# EasyEDA Pro project 传感器pack.eprj

# Schematic Schematic1

## Sheets
1 controller: Create Date: 2023-05-07; Page Name: controller; Project Name: 传感器pack; Schematic Name: Schematic1; Update Date: 2023-06-27; Company: 嘉立创EDA; Page Size: A4; Version: V1.0
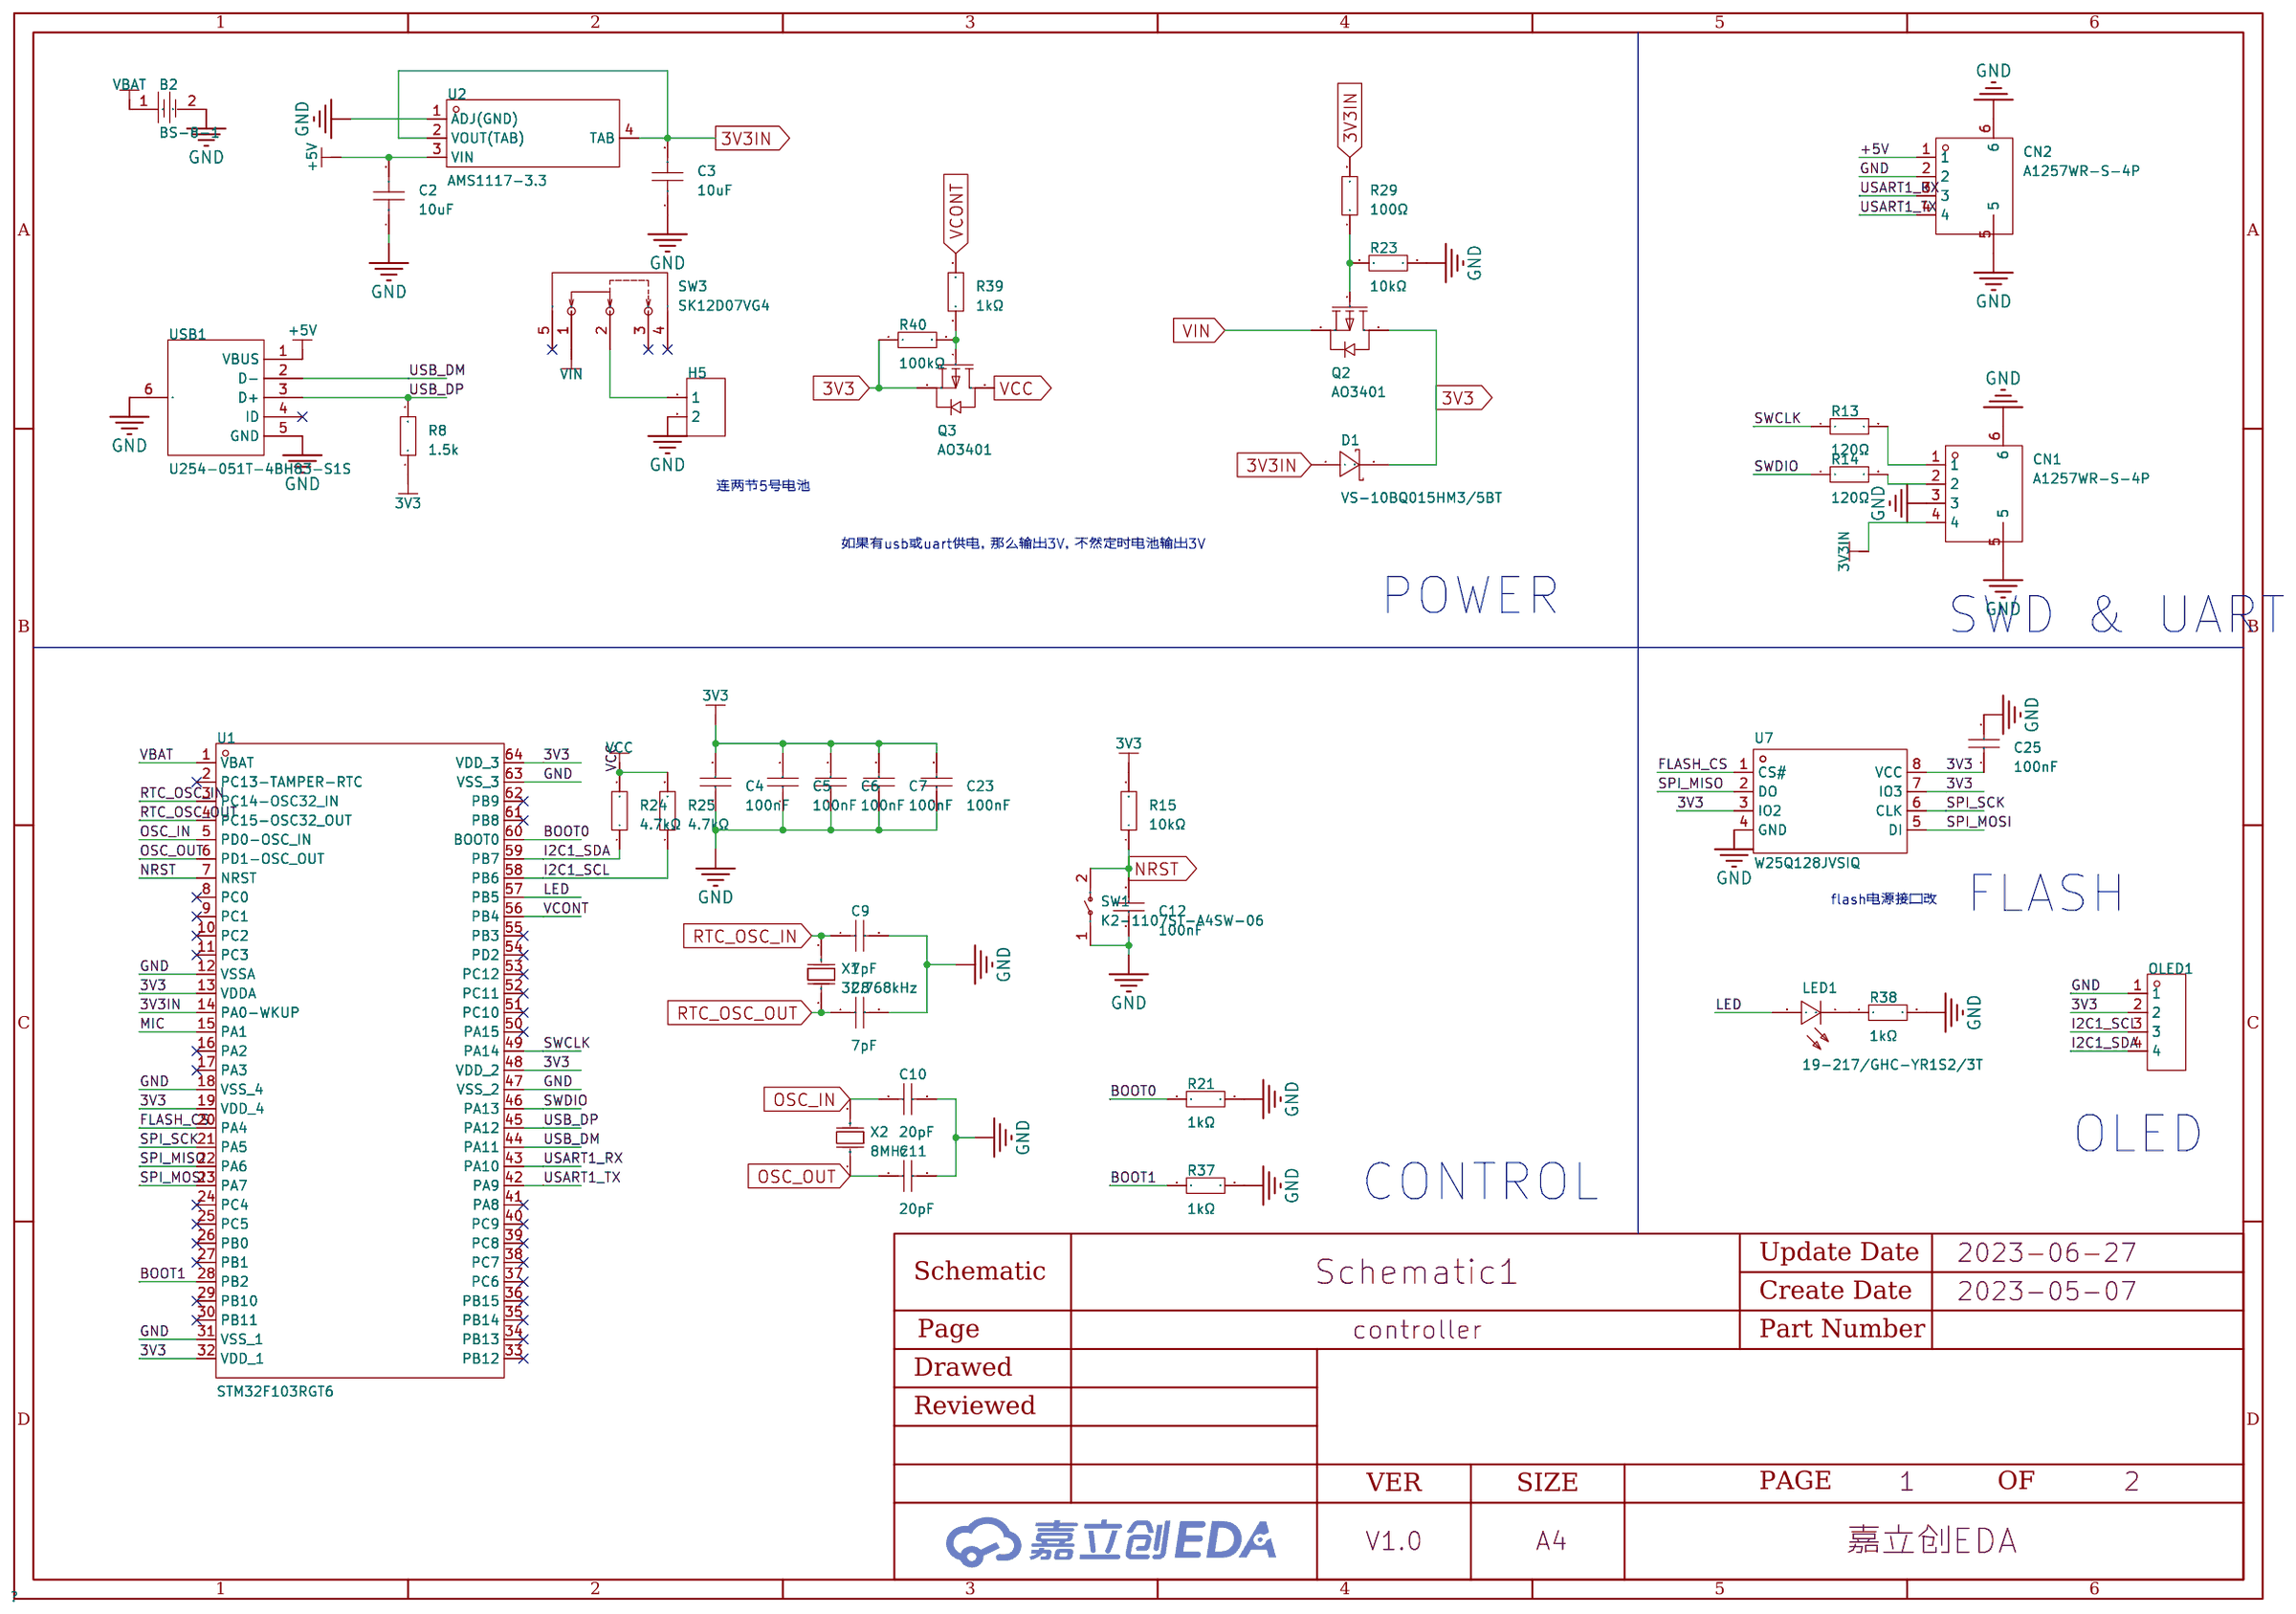
[diagram p0: controller]
2 sensor: Create Date: 2023-05-13; Page Name: sensor
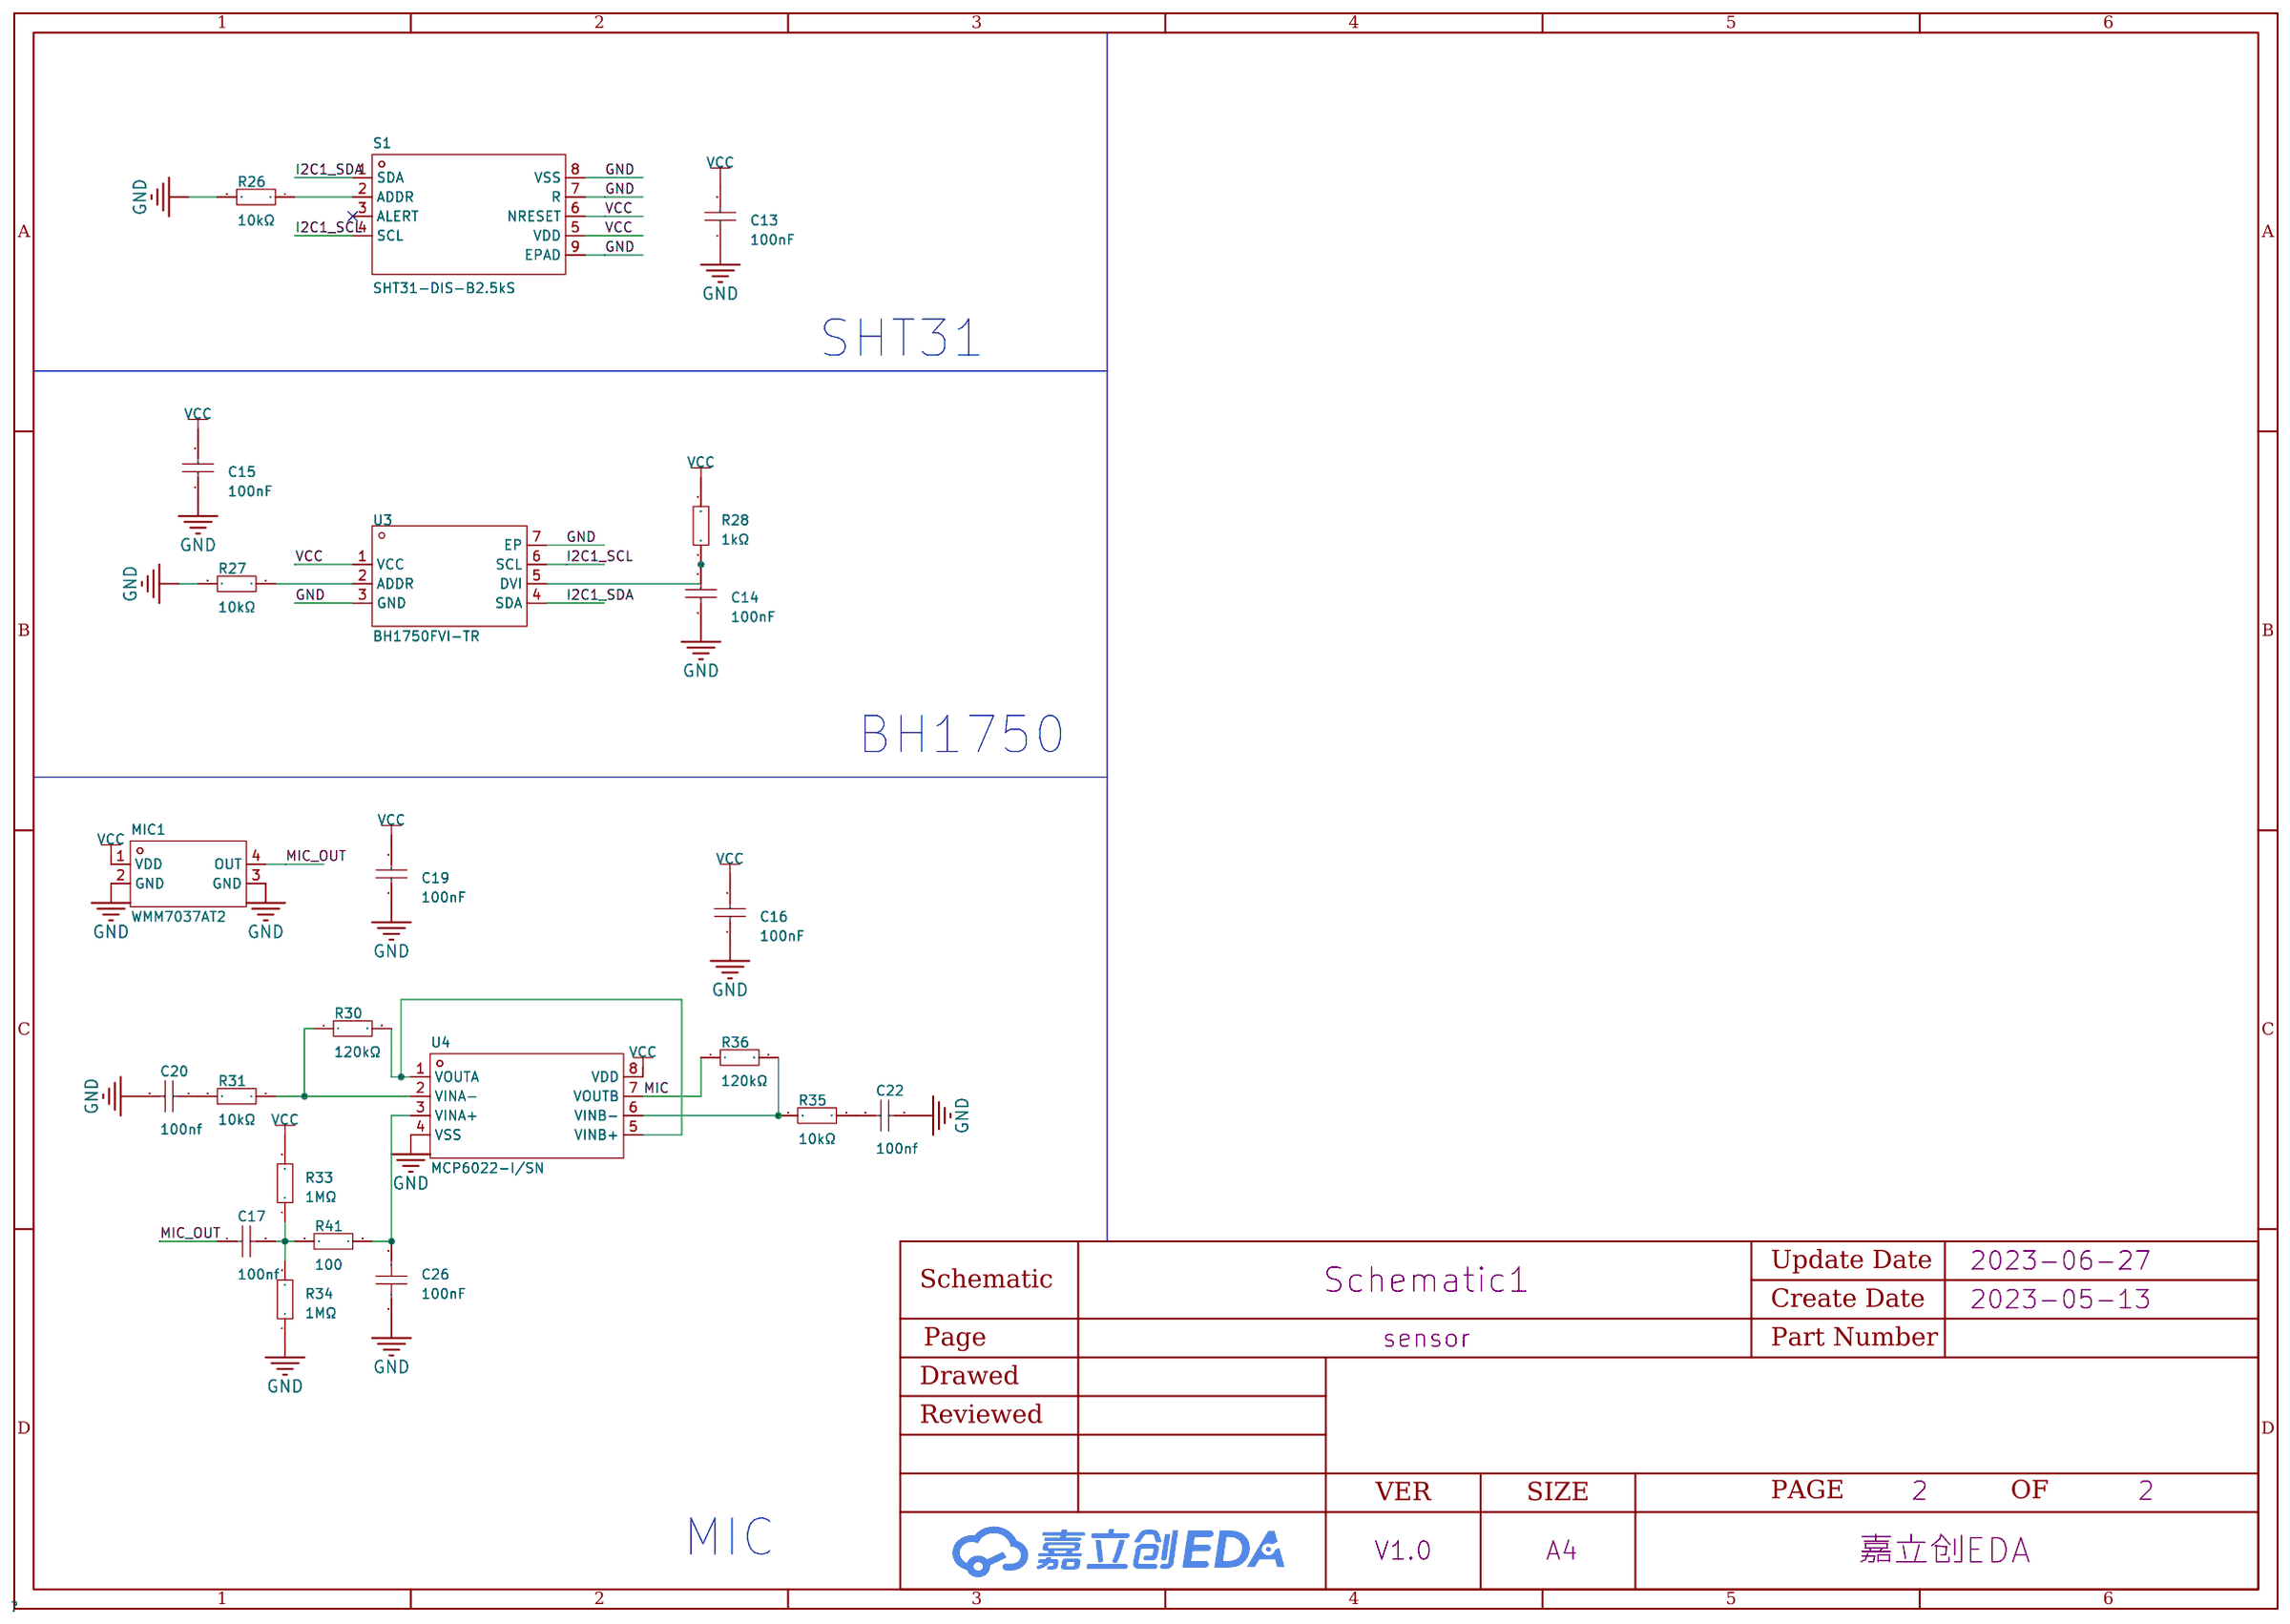
[diagram p1: sensor]

## Parts
sheet controller
B2  BS-8-1  [BAT-TH_BS-8-1]
C2  10uF  [C0603]
C3  10uF  [C0603]
C4  100nF  [C0603]
C5  100nF  [C0603]
C6  100nF  [C0603]
C7  100nF  [C0603]
C8  7pF  [C0603]
C9  7pF  [C0603]
C10  20pF  [C0603]
C11  20pF  [C0603]
C12  100nF  [C0603]
C23  100nF  [C0603]
C25  100nF  [C0603]
CN1  A1257WR-S-4P  [CONN-SMD_A1257WR-S-4P]
CN2  A1257WR-S-4P  [CONN-SMD_A1257WR-S-4P]
D1  VS-10BQ015HM3/5BT  [SMB_L4.6-W3.6-LS5.3-RD]
H5  -  [HDR-TH_2P-P2.54-V-F]
LED1  19-217/GHC-YR1S2/3T  [LED0603-RD]
OLED1  -  [HDR-TH_4P-P2.54-V-F]
Q2  AO3401  [SOT-23-3_L2.9-W1.4-P1.90-LS2.6-BR]
Q3  AO3401  [SOT-23-3_L2.9-W1.4-P1.90-LS2.6-BR]
R8  1.5k  [R0603]
R13  120Ω  [R0603]
R14  120Ω  [R0603]
R15  10kΩ  [R0603]
R21  1kΩ  [R0603]
R23  10kΩ  [R0603]
R24  4.7kΩ  [R0603]
R25  4.7kΩ  [R0603]
R29  100Ω  [R0603]
R37  1kΩ  [R0603]
R38  1kΩ  [R0603]
R39  1kΩ  [R0603]
R40  100kΩ  [R0603]
SW1  K2-1107ST-A4SW-06  [SW-SMD_L6.1-W3.6-LS7.9]
SW3  SK12D07VG4  [SW-TH_SK12D07VG4]
U1  STM32F103RGT6  [LQFP-64_L10.0-W10.0-P0.50-LS12.0-BL]
U2  AMS1117-3.3  [SOT-223-4_L6.5-W3.5-P2.30-LS7.0-BR]
U7  W25Q128JVSIQ  [SOIC-8_L5.3-W5.3-P1.27-LS8.0-BL]
USB1  U254-051T-4BH83-S1S  [MICRO-USB-SMD_U254-051T-4BH83-S1S]
X1  32.768kHz  [FC-12M_L2.0-W1.2]
X2  8MHz  [CRYSTAL-SMD_L5.0-W3.2]
sheet sensor
C13  100nF  [C0603]
C14  100nF  [C0603]
C15  100nF  [C0603]
C16  100nF  [C0603]
C17  100nf  [C0603]
C19  100nF  [C0603]
C20  100nf  [C0603]
C22  100nf  [C0603]
C26  100nF  [C0603]
MIC1  WMM7037AT2  [MIC-SMD_L3.8-W3.00-TL]
R26  10kΩ  [R0603]
R27  10kΩ  [R0603]
R28  1kΩ  [R0603]
R30  120kΩ  [R0603]
R31  10kΩ  [R0603]
R33  1MΩ  [R0603]
R34  1MΩ  [R0603]
R35  10kΩ  [R0603]
R36  120kΩ  [R0603]
R41  100  [R0603]
S1  SHT31-DIS-B2.5kS  [DFN-8_L2.5-W2.5-P0.50-BL-EP]
U3  BH1750FVI-TR  [WSOF-6_L2.6-W1.6-P0.50-TL-EP]
U4  MCP6022-I/SN  [SOIC-8_L4.9-W3.9-P1.27-LS6.0-BL]

## Library data of the parts
B2 = BS-8-1: 连接器类型:电池底座;适用电池规格:CR2032;工作温度范围:-55℃~+85℃;; LCSC Part Name: 电池底座 适用电池:CR2032 镀金; Supplier Part: C70378; Manufacturer: Q&J; Supplier Footprint: SMD; JLCPCB Part Class: Extended Part; Datasheet: https://atta.szlcsc.com/upload/public/pdf/source/20160427/1461725216590.pdf; Supplier: LCSC; Connector Type: 电池底座; Battery Type: CR2032; Operating Temperature Range: -55℃~+85℃
C2 C3 = CL10A106MA8NRNC: 容值:10uF;精度:±20%;额定电压:25V;材质(温度系数):X5R;; LCSC Part Name: 10uF ±20% 25V; Supplier Part: C96446; Manufacturer: SAMSUNG(三星); Supplier Footprint: 0603; JLCPCB Part Class: Basic Part; Datasheet: https://atta.szlcsc.com/upload/public/pdf/source/20170325/1490427913016.pdf; Supplier: LCSC; Tolerance: ±20%; Voltage Rated: 25V; Temperature Coefficient: X5R
C4-C7 C12-C16 C19 C20 C22 C23 C25 = 0603B104K500NT: 容值:100nF;精度:±10%;额定电压:50V;材质(温度系数):X7R;; LCSC Part Name: 100nF ±10% 50V; Supplier Part: C30926; Manufacturer: FH(风华); Supplier Footprint: 0603; JLCPCB Part Class: Extended Part; Datasheet: https://atta.szlcsc.com/upload/public/pdf/source/20170923/C30926_1506149436298988724.pdf; Supplier: LCSC; Tolerance: ±10%; Voltage Rated: 50V; Temperature Coefficient: X7R
C8 C9 = 0603CG7R0C500NT: 容值:7pF;额定电压:50V;材质(温度系数):C0G;; LCSC Part Name: 7pF 50V ±0.25pF; Supplier Part: C1682; Manufacturer: FH(风华); Supplier Footprint: 0603; JLCPCB Part Class: Extended Part; Datasheet: https://atta.szlcsc.com/upload/public/pdf/source/20170923/C1682_1506149316801988467.pdf; Supplier: LCSC; Voltage Rated: 50V; Temperature Coefficient: C0G
C10 C11 = CL10C200JB8NNNC: 容值:20pF;精度:±5%;额定电压:50V;材质(温度系数):C0G;; LCSC Part Name: 20pF ±5% 50V; Supplier Part: C1648; Manufacturer: SAMSUNG(三星); Supplier Footprint: 0603; JLCPCB Part Class: Basic Part; Datasheet: https://atta.szlcsc.com/upload/public/pdf/source/20160103/1457707686863.pdf; Supplier: LCSC; Tolerance: ±5%; Voltage Rated: 50V; Temperature Coefficient: C0G
CN1 CN2 = A1257WR-S-4P: 参考系列:GH;间距:1.25mm;插针结构:1x4P;排数:1;每排PIN数:4;行距:-;安装方式:-;触头材质:黄铜;; LCSC Part Name: GH1.25卧式贴片 镀锡 4P 针座连接器; Supplier Part: C225127; Manufacturer: CJT(长江连接器); Supplier Footprint: SMD,P=1.25mm; JLCPCB Part Class: Extended Part; Datasheet: https://atta.szlcsc.com/upload/public/pdf/source/20180509/C225127_D8D3C7F8F1F45F960D198B1E232900BE.pdf; Supplier: LCSC; Reference Series: GH; Pitch: 1.25mm; Pins Structure: 1x4P; Number of Rows: 1; Number of PINs Per Row: 4; Contact Material: 黄铜
D1 = VS-10BQ015HM3/5BT: 直流反向耐压(Vr):15V;平均整流电流(Io):1A;正向压降(Vf):210mV@1A;; LCSC Part Name: 15V 1A 210mV@1A; Supplier Part: C413465; Manufacturer: VISHAY(威世); Supplier Footprint: SMB; JLCPCB Part Class: Extended Part; Datasheet: https://atta.szlcsc.com/upload/public/pdf/source/20190819/C413465_3D2B1A8C7366D4425AB887DF85498F89.pdf; Supplier: LCSC; Reverse Voltage (Vr): 15V; Average Rectified Current (Io): 1A; Forward Voltage (Vf@If): 210mV@1A
H5 = HDR-F_2.54_1x2P: Supplier Part: C49661; Supplier Footprint: 插件
LED1 = 19-217/GHC-YR1S2/3T: 发光颜色:翠绿;二极管配置:-;主波长:520nm~535nm;色温:-;功率:110mW;安装方式:-;; Supplier Part: C72043; Manufacturer: EVERLIGHT(亿光); Supplier Footprint: 0603; JLCPCB Part Class: Basic Part; Datasheet: https://atta.szlcsc.com/upload/public/pdf/source/20160507/1462613613780.pdf; Supplier: LCSC; Emitted Color: 翠绿; Lens Color: 无色透明; Dominant Wavelength: 520nm~535nm; Peak Wavelength: 518nm; Forward Current: 20mA; Power Dissipation: 110mW; Viewing Angle: 120°; Operating Temperature: -40℃~+85℃
OLED1 = HDR-F_2.54_1x4P: Supplier Part: C2718488; Supplier Footprint: 插件
Q2 Q3 = AO3401_C727156: 类型:P沟道;漏源电压(Vdss):30V;连续漏极电流(Id):4.2A;功率(Pd):350mW;导通电阻(RDS(on)@Vgs,Id):65mΩ@10V,4.2A;; LCSC Part Name: P沟道 30V 4.2A; Supplier Part: C727156; Manufacturer: TWGMC(台湾迪嘉); Supplier Footprint: SOT-23; JLCPCB Part Class: Extended Part; Datasheet: https://atta.szlcsc.com/upload/public/pdf/source/20200827/C727156_6E081BBEEFBC6B8FEE164CB196B0AF30.pdf; Supplier: LCSC; Type: P沟道; Drain Source Voltage (Vdss): 30V; Continuous Drain Current (Id): 4.2A; Power Dissipation (Pd): 350mW; Drain Source On Resistance (RDS(on)@Vgs,Id): 65mΩ@10V,4.2A; Gate Threshold Voltage (Vgs(th)@Id): 1.3V@250uA
R8 R24 R25 = 0603WAF4701T5E: 电阻类型:厚膜电阻;阻值:4.7kΩ;精度:±1%;功率:100mW;; LCSC Part Name: 4.7kΩ ±1% 100mW; Supplier Part: C23162; Manufacturer: UNI-ROYAL(厚声); Supplier Footprint: 0603; JLCPCB Part Class: Basic Part; Datasheet: https://atta.szlcsc.com/upload/public/pdf/source/20200306/C422600_1E6D84923E4A46A82E41ADD87F860B5C.pdf; Supplier: LCSC; Type: 厚膜电阻; Tolerance: ±1%; Power(Watts): 100mW; Temperature Coefficient: ±100ppm/℃; Overload Voltage (Max): 75V; Operating Temperature Range: -55℃~+155℃
R13 R14 = 0603WAF1200T5E: 电阻类型:厚膜电阻;阻值:120Ω;精度:±1%;功率:100mW;; LCSC Part Name: 120Ω ±1% 100mW; Supplier Part: C22787; Manufacturer: UNI-ROYAL(厚声); Supplier Footprint: 0603; JLCPCB Part Class: Basic Part; Datasheet: https://atta.szlcsc.com/upload/public/pdf/source/20200306/C422600_1E6D84923E4A46A82E41ADD87F860B5C.pdf; Supplier: LCSC; Type: 厚膜电阻; Tolerance: ±1%; Power(Watts): 100mW; Temperature Coefficient: ±100ppm/℃; Overload Voltage (Max): 75V; Operating Temperature Range: -55℃~+155℃
R15 R23 R26 R27 R31 R35 = 0603WAF1002T5E: 电阻类型:厚膜电阻;阻值:10kΩ;精度:±1%;功率:100mW;; LCSC Part Name: 厚膜电阻 10kΩ ±1% 100mW; Supplier Part: C25804; Manufacturer: UNI-ROYAL(厚声); Supplier Footprint: 0603; JLCPCB Part Class: Basic Part; Datasheet: https://atta.szlcsc.com/upload/public/pdf/source/20200306/C422600_1E6D84923E4A46A82E41ADD87F860B5C.pdf; Supplier: LCSC; Type: 厚膜电阻; Tolerance: ±1%; Power(Watts): 100mW; Temperature Coefficient: ±100ppm/℃; Overload Voltage (Max): 75V; Operating Temperature Range: -55℃~+155℃
R21 R28 R37-R39 = 0603WAF1001T5E: 电阻类型:厚膜电阻;阻值:1kΩ;精度:±1%;功率:100mW;; LCSC Part Name: 1kΩ ±1% 100mW; Supplier Part: C21190; Manufacturer: UNI-ROYAL(厚声); Supplier Footprint: 0603; JLCPCB Part Class: Basic Part; Datasheet: https://atta.szlcsc.com/upload/public/pdf/source/20200306/C422600_1E6D84923E4A46A82E41ADD87F860B5C.pdf; Supplier: LCSC; Type: 厚膜电阻; Tolerance: ±1%; Power(Watts): 100mW; Temperature Coefficient: ±100ppm/℃; Overload Voltage (Max): 75V; Operating Temperature Range: -55℃~+155℃
R29 = 0603WAF1000T5E: 电阻类型:厚膜电阻;阻值:100Ω;精度:±1%;功率:100mW;; LCSC Part Name: 100Ω ±1% 100mW; Supplier Part: C22775; Manufacturer: UNI-ROYAL(厚声); Supplier Footprint: 0603; JLCPCB Part Class: Basic Part; Datasheet: https://atta.szlcsc.com/upload/public/pdf/source/20200306/C422600_1E6D84923E4A46A82E41ADD87F860B5C.pdf; Supplier: LCSC; Type: 厚膜电阻; Tolerance: ±1%; Power(Watts): 100mW; Temperature Coefficient: ±200ppm/℃; Overload Voltage (Max): 75V; Operating Temperature Range: -55℃~+155℃
R40 = 0603WAF1003T5E: 电阻类型:厚膜电阻;阻值:100kΩ;精度:±1%;功率:100mW;; LCSC Part Name: 100kΩ ±1% 100mW; Supplier Part: C25803; Manufacturer: UNI-ROYAL(厚声); Supplier Footprint: 0603; JLCPCB Part Class: Basic Part; Datasheet: https://atta.szlcsc.com/upload/public/pdf/source/20200306/C422600_1E6D84923E4A46A82E41ADD87F860B5C.pdf; Supplier: LCSC; Type: 厚膜电阻; Tolerance: ±1%; Power(Watts): 100mW; Temperature Coefficient: ±100ppm/℃; Overload Voltage (Max): 75V; Operating Temperature Range: -55℃~+155℃
SW1 = K2-1107ST-A4SW-06: 触点电流:50mA;额定电压(DC):12V;绝缘电阻:100MΩ;安装方式:立贴;作用力:250gf@±30gf;机械寿命:100000;工作温度:-25℃~+85℃;开关长度:6mm;开关宽度:3.6mm;开关高度:2.5mm;; Supplier Part: C2837195; Manufacturer: 韩国韩荣; Supplier Footprint: SMD; JLCPCB Part Class: Extended Part; Datasheet: https://atta.szlcsc.com/upload/public/pdf/source/20210810/381712CEF248770C072B585C3485C888.pdf; Supplier: LCSC; Contact Current: 50mA; Voltage Rating (DC): 12V; Insulation Resistance: 100MΩ; Mounting Style: 立贴; Operating Force: 250gf@±30gf; Mechanical Life: 100000; Operating Temperature: -25℃~+85℃; Switch Length: 6mm; Switch Width: 3.6mm; Switch Height: 2.5mm
SW3 = SK12D07VG4: 额定电压 DC:50V;触点额定电流:500mA @ 50VDC;电路结构:SPDT;额定电压 AC:-;开关功能:On-On;; LCSC Part Name: 3脚2二档位SK12D07VG4滑动开关1P2T卧式拨动开关; Supplier Part: C393937; Manufacturer: SHOU HAN(首韩); Supplier Footprint: 插件,P=2mm; JLCPCB Part Class: Extended Part; Datasheet: https://atta.szlcsc.com/upload/public/pdf/source/20190521/C393937_939FE26E571CC67D2D532E953108A1B0.pdf; Supplier: LCSC; Operating Force: 130~330gf; Contact Material: Brass; Rated Voltage(DC): 50V; Contact Rating @ Voltage: 500mA @ 50VDC; Circuit: SPDT; Electrical Life Cycles: 5000; Mounting Type: Through Hole, Right Angle; Switch Function: On-On; Switch Height: 4mm; Actuator Orientation: Horizontal; Contact Timing: Shorting (MBB); Termination Style: PC 引脚; Actuator Type: Standard
U1 = STM32F103RGT6: CPU内核:ARM Cortex-M3;CPU最大主频:72MHz;程序存储容量:1MB;程序存储器类型:FLASH;RAM总容量:96KB;GPIO端口数量:51;; LCSC Part Name: ARM Cortex-M3 72MHz; Supplier Part: C8317; Manufacturer: ST(意法半导体); Supplier Footprint: LQFP-64(10x10); JLCPCB Part Class: Extended Part; Datasheet: https://atta.szlcsc.com/upload/public/pdf/source/20140724/1457707171207.pdf; Supplier: LCSC; CPU Core: ARM Cortex-M3; CPU Maximum Speed: 72MHz; Operating Voltage Range: 2V~3.6V; Program Storage Size: 1MB; Program Memory Type: FLASH; RAM Size: 96KB; EEPROM: 1MB; GPIO Ports Number: 51; ADC (Bit): 12bit; DAC (Bit): 12bit; Universal Serial Bus: 有; Peripheral/Function: 看门狗；DMA；看门狗；片载温度传感器; Watchdog: 有; Infrared Data Association: 有; Low-Voltage Detect: 有; Direct Memory Access: 有; Internal Oscillator: 有; Operating Temperature Range: -40℃~+85℃
U2 = AMS1117-3.3_C347222: 输出类型:固定;输出极性:正;最大输入电压:18V;输出电压:3.3V;输出电流:1A;电源纹波抑制比(PSRR):60dB@(120Hz);; Supplier Part: C347222; Manufacturer: UMW(广东友台半导体); Supplier Footprint: SOT-223; JLCPCB Part Class: Extended Part; Datasheet: https://atta.szlcsc.com/upload/public/pdf/source/20211011/50CC665C22E3A66C08379A4A74BDA25C.pdf; Supplier: LCSC; Output Type: 固定; Output Polarity: 正; Number of Outputs: 1; Maximum Input Voltage: 18V; Output Voltage: 3.3V; Dropout Voltage: 1.3V@(1A); Output Current: 1A; Power Supply Rejection Ratio (PSRR): 60dB@(120Hz)
U7 = W25Q128JVSIQ: 128Mbit(16MBx8bit),高速版,133MHz(266/532MHz Dual/Quad-SPI,66MB/S),比W25Q128FVSIG,W25Q128FVFIG更高速; Supplier Part: C97521; Manufacturer: WINBOND(华邦); Supplier Footprint: SOIC-8-208mil; JLCPCB Part Class: Basic Part; Datasheet: https://atta.szlcsc.com/upload/public/pdf/source/20170316/1489627409956.pdf; Supplier: LCSC
USB1 = U254-051T-4BH83-S1S: 连接器类型:Micro-B;标准:USB 2.0;公母:母座;触点数量:5;端口数量:1;安装方式:卧贴;额定电流 - 电源:1.8A;触头材质:铜合金;触头镀层:金;工作温度范围:-20℃~+85℃;焊接温度(最大值):260℃;; LCSC Part Name: Micro-B 母座 卧贴; Supplier Part: C319160; Manufacturer: XKB Connectivity(中国星坤); Supplier Footprint: SMD; JLCPCB Part Class: Extended Part; Datasheet: https://atta.szlcsc.com/upload/public/pdf/source/20200303/C482359_94FADDBDAD8A1CD1662C83166295E6D9.pdf; Supplier: LCSC; Connector Type: Micro-B; Standard: USB 2.0; Gender: 母座; Number of Contacts: 5; Number of Ports: 1; Mounting Style: 卧贴; Current Rating - Power (Max): 1.8A; Contact Material: 铜合金; Contact Plating: 金; Operating Temperature Range: -20℃~+85℃; Welding Temperature (Max): 260℃
X1 = FC-12M32.768KHZ7PF20PPM: 频率:32.768kHz;频率公差:±20ppm;负载电容:7pF;; LCSC Part Name: 32.768kHz ±20ppm 7pF; Supplier Part: C99009; Manufacturer: EPSON(爱普生); Supplier Footprint: SMD2012-2P; JLCPCB Part Class: Extended Part; Datasheet: https://atta.szlcsc.com/upload/public/pdf/source/20201208/C99009_C8E15F958CFE3CE2EDA27C0490B1C4AB.pdf; Supplier: LCSC; Crystal Type: 贴片无源晶振; Frequency Tolerance: ±20ppm; Load Capacitance: 7pF; Equivalent Series Resistance (ESR): 90kΩ; Operating Temperature: -40℃~+85℃
X2 = X50328MSB2GI: 频率:8MHz;频率公差:±10ppm;负载电容:20pF;; LCSC Part Name: 8MHz ±10ppm 20pF YSX530GA; Supplier Part: C115962; Manufacturer: YXC(扬兴晶振); Supplier Footprint: SMD5032-2P; JLCPCB Part Class: Basic Part; Datasheet: https://atta.szlcsc.com/upload/public/pdf/source/20230220/0EBFFB9D6D8CE6A211407822BBB6C516.pdf; Supplier: LCSC; Crystal Type: 贴片无源晶振; Frequency Tolerance: ±10ppm; Frequency Stability: ±50ppm; Load Capacitance: 20pF; Operating Temperature: -40℃~+85℃
C17 = CL10A105KB8NNNC: 容值:1uF;精度:±10%;额定电压:50V;材质(温度系数):X5R;; LCSC Part Name: 1uF ±10% 50V; Supplier Part: C15849; Manufacturer: SAMSUNG(三星); Supplier Footprint: 0603; JLCPCB Part Class: Basic Part; Datasheet: https://atta.szlcsc.com/upload/public/pdf/source/20160103/1457707679084.pdf; Supplier: LCSC; Tolerance: ±10%; Voltage Rated: 50V; Temperature Coefficient: X5R
C26 = CAP_0603: Supplier Footprint: 0603
MIC1 = WMM7037AT2: 方向:全指向;灵敏度:-42dB;信噪比:59dB;电流消耗:80uA;电源电压:1.5V~3.6V;阻抗:200Ω;; LCSC Part Name: 3.76*2.95*1.1; Supplier Part: C140705; Manufacturer: WILLSEMI(韦尔); Supplier Footprint: LGA-4(3x3.8); JLCPCB Part Class: Extended Part; Datasheet: https://atta.szlcsc.com/upload/public/pdf/source/20171110/C140705_15102791561741104113.pdf; Supplier: LCSC; Direction: 全指向; Sensitivity: -42dB; SNR(Signal to Noise Ratio): 59dB; Current Consumption: 80uA; Supply Voltage: 1.5V~3.6V; Impedance: 200Ω
R30 R36 = 0603WAF1203T5E: 电阻类型:厚膜电阻;阻值:120kΩ;精度:±1%;功率:100mW;; LCSC Part Name: 120kΩ ±1% 100mW; Supplier Part: C25808; Manufacturer: UNI-ROYAL(厚声); Supplier Footprint: 0603; JLCPCB Part Class: Basic Part; Datasheet: https://atta.szlcsc.com/upload/public/pdf/source/20200306/C422600_1E6D84923E4A46A82E41ADD87F860B5C.pdf; Supplier: LCSC; Type: 厚膜电阻; Tolerance: ±1%; Power(Watts): 100mW; Temperature Coefficient: ±100ppm/℃; Overload Voltage (Max): 75V; Operating Temperature Range: -55℃~+155℃
R33 R34 = 0603WAF1004T5E: 电阻类型:厚膜电阻;阻值:1MΩ;精度:±1%;功率:100mW;; LCSC Part Name: 1MΩ ±1% 100mW; Supplier Part: C22935; Manufacturer: UNI-ROYAL(厚声); Supplier Footprint: 0603; JLCPCB Part Class: Basic Part; Datasheet: https://atta.szlcsc.com/upload/public/pdf/source/20200306/C422600_1E6D84923E4A46A82E41ADD87F860B5C.pdf; Supplier: LCSC; Type: 厚膜电阻; Tolerance: ±1%; Power(Watts): 100mW; Temperature Coefficient: ±100ppm/℃; Overload Voltage (Max): 75V; Operating Temperature Range: -55℃~+155℃
R41 = Res_0603: Supplier Footprint: 0603
S1 = SHT31-DIS-B2.5kS: 数字式温湿度传感器SHT31， RH精度：0-100%全量程典型误差值±2%，比SHT30更高精度，DFN封装，; Supplier Part: C80862; Manufacturer: Sensirion(瑞士盛思锐); Supplier Footprint: DFN-8-EP(3x3); JLCPCB Part Class: Extended Part; Datasheet: https://atta.szlcsc.com/upload/public/pdf/source/20160903/1472896604401.pdf; Supplier: LCSC
U3 = BH1750FVI-TR: 数字16-bit I2C串行输出，环境光传感器，工作电压：2.4V~3.6V; Supplier Part: C78960; Manufacturer: ROHM(罗姆); Supplier Footprint: WSOF-6; JLCPCB Part Class: Extended Part; Datasheet: https://atta.szlcsc.com/upload/public/pdf/source/20160723/1469258984787.pdf; Supplier: LCSC
U4 = MCP6022-I/SN: 运放类型:宽带运放;放大器组数:2;增益带宽积（GBP）:10MHz;压摆率（SR）:7 V/us;电源电压:2.5V ~ 5.5V;各通道供电电流:1mA;; Supplier Part: C34047; Manufacturer: MICROCHIP(美国微芯); Supplier Footprint: SOIC-8-150mil; JLCPCB Part Class: Extended Part; Datasheet: https://atta.szlcsc.com/upload/public/pdf/source/20140723/1457707156733.pdf; Supplier: LCSC; Amplifier Type: 宽带运放; Number of Circuits: 2; Current - Input Bias（Ib）: 1pA; Voltage - Input Offset（Vos）: 500uV; Gain Bandwidth Product（GBP）: 10MHz; Slew Rate（SR）: 7 V/us; Output Type: 满摆幅; Supply Voltage（Single）: 2.5V ~ 5.5V; Iq per channel (Typ): 1mA; Operating Temperature: -40℃~85℃

## Nets
3V3: C4.2 C5.2 C6.2 C7.2 C23.2 C25.1 D1.1(C) OLED1.2 Q2.3(D) Q3.2(S) R8.1 R15.2 R40.1 U1.13(VDDA) U1.19(VDD_4) U1.32(VDD_1) U1.48(VDD_2) U1.64(VDD_3) U7.3(IO2) U7.7(IO3) U7.8(VCC)
3V3IN: C3.2 CN1.4 D1.2(A) R29.2 U1.14(PA0-WKUP) U2.2(VOUT(TAB)) U2.4(TAB)
+5V: C2.2 CN2.1 U2.3(VIN) USB1.1(VBUS)
GND: B2.2 C2.1 C3.1 C4.1 C5.1 C6.1 C7.1 C8.2 C9.2 C10.2 C11.2 C12.1 C13.1 C14.1 C15.1 C16.1 C19.1 C20.2 C22.2 C23.1 C25.2 C26.1 CN1.3 CN1.5 CN1.6 CN2.2 CN2.5 CN2.6 H5.2 MIC1.2(GND) MIC1.3(GND) OLED1.1 R21.2 R23.1 R26.2 R27.2 R34.1 R37.2 R38.2 S1.7(R) S1.8(VSS) S1.9(EPAD) SW1.1 U1.12(VSSA) U1.18(VSS_4) U1.31(VSS_1) U1.47(VSS_2) U1.63(VSS_3) U2.1(ADJ(GND)) U3.3(GND) U3.7(EP) U4.4(VSS) U7.4(GND) USB1.5(GND) USB1.6(EH)
VBAT: B2.1 U1.1(VBAT)
VCC: C13.2 C15.2 C16.2 C19.2 MIC1.1(VDD) Q3.3(D) R24.2 R25.2 R28.2 R33.2 S1.5(VDD) S1.6(NRESET) U3.1(VCC) U4.8(VDD)
VIN: Q2.2(S) SW3.1
BOOT0: R21.1 U1.60(BOOT0)
BOOT1: R37.1 U1.28(PB2)
FLASH_CS: U1.20(PA4) U7.1(CS#)
I2C1_SCL: OLED1.3 R25.1 S1.4(SCL) U1.58(PB6) U3.6(SCL)
I2C1_SDA: OLED1.4 R24.1 S1.1(SDA) U1.59(PB7) U3.4(SDA)
LED: LED1.2(A) U1.57(PB5)
MIC: R36.1 U1.15(PA1) U4.7(VOUTB)
MIC_OUT: C17.1 MIC1.4(OUT)
NRST: C12.2 R15.1 SW1.2 U1.7(NRST)
OSC_IN: C10.1 U1.5(PD0-OSC_IN) X2.2(OSC2)
OSC_OUT: C11.1 U1.6(PD1-OSC_OUT) X2.1(OSC1)
RTC_OSC_IN: C9.1 U1.3(PC14-OSC32_IN) X1.2(OSC2)
RTC_OSC_OUT: C8.1 U1.4(PC15-OSC32_OUT) X1.1(OSC1)
SPI_MISO: U1.22(PA6) U7.2(DO)
SPI_MOSI: U1.23(PA7) U7.5(DI)
SPI_SCK: U1.21(PA5) U7.6(CLK)
SWCLK: R13.1 U1.49(PA14)
SWDIO: R14.1 U1.46(PA13)
USART1_RX: CN2.3 U1.43(PA10)
USART1_TX: CN2.4 U1.42(PA9)
USB_DM: U1.44(PA11) USB1.2(D-)
USB_DP: R8.2 U1.45(PA12) USB1.3(D+)
VCONT: R39.2 U1.56(PB4)
$1N4035: Q2.1(G) R23.2 R29.1
$1N4154: CN1.1 R13.2
$1N4190: CN1.2 R14.2
$1N11068: LED1.1(C) R38.1
$1N11257: H5.1 SW3.2
$1N13765: Q3.1(G) R39.1 R40.2
$2N250: R26.1 S1.2(ADDR)
$2N452: R27.1 U3.2(ADDR)
$2N578: C14.2 R28.1 U3.5(DVI)
$2N2027: C20.1 R31.2
$2N2052: R30.1 R31.1 U4.2(VINA-)
$2N2158: R30.2 U4.1(VOUTA) U4.5(VINB+)
$2N2251: C22.1 R35.2
$2N2310: R35.1 R36.2 U4.6(VINB-)
$2N5780: C17.2 R33.1 R34.2 R41.1
$2N5887: C26.2 R41.2 U4.3(VINA+)

Not connected (* = marked no-connect by the designer): S1 3(ALERT)*; SW3 3* 4* 5*; U1 2(PC13-TAMPER-RTC)* 8(PC0)* 9(PC1)* 10(PC2)* 11(PC3)* 16(PA2)* 17(PA3)* 24(PC4)* 25(PC5)* 26(PB0)* 27(PB1)* 29(PB10)* 30(PB11)* 33(PB12)* 34(PB13)* 35(PB14)* 36(PB15)* 37(PC6)* 38(PC7)* 39(PC8)* 40(PC9)* 41(PA8)* 50(PA15)* 51(PC10)* 52(PC11)* 53(PC12)* 54(PD2)* 55(PB3)* 61(PB8)* 62(PB9)*; USB1 4(ID)*

## Notes on the sheets
sheet 1
- 连两节5号电池
- 如果有usb或uart供电，那么输出3V，不然定时电池输出3V
- POWER
- SWD & UART
- flash电源接口改
- FLASH
- OLED
- CONTROL
sheet 2
- SHT31
- BH1750
- MIC

# Board PCB1
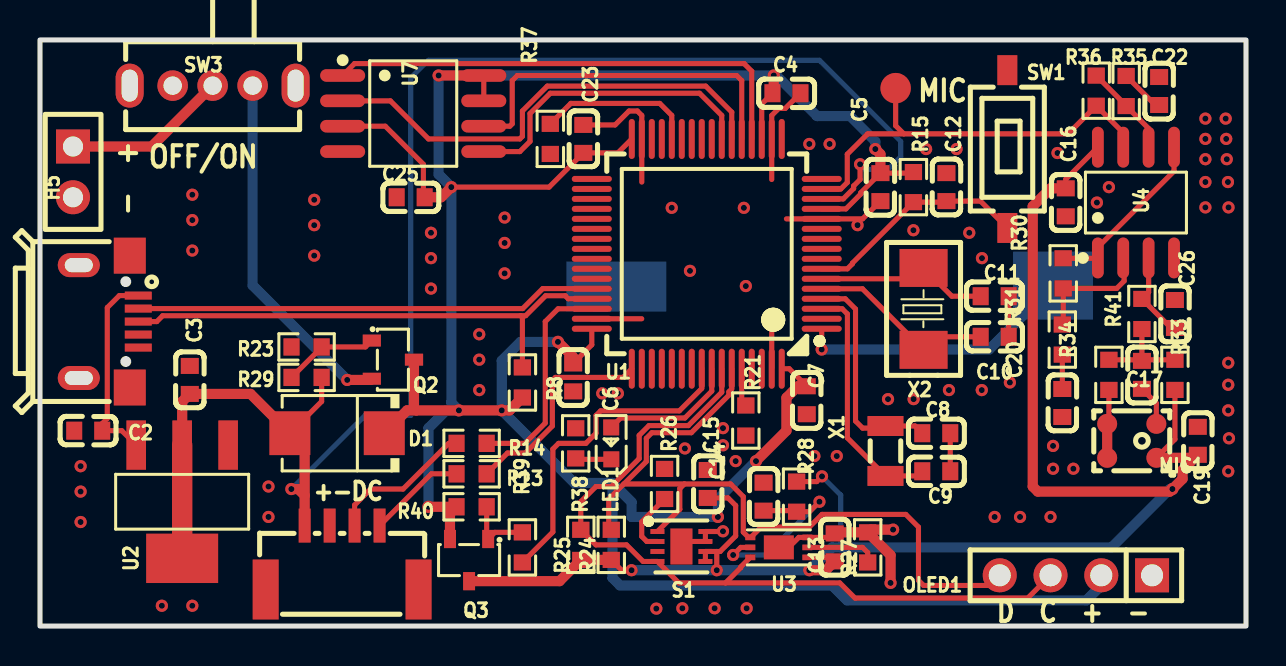
[diagram p2: board, top side]
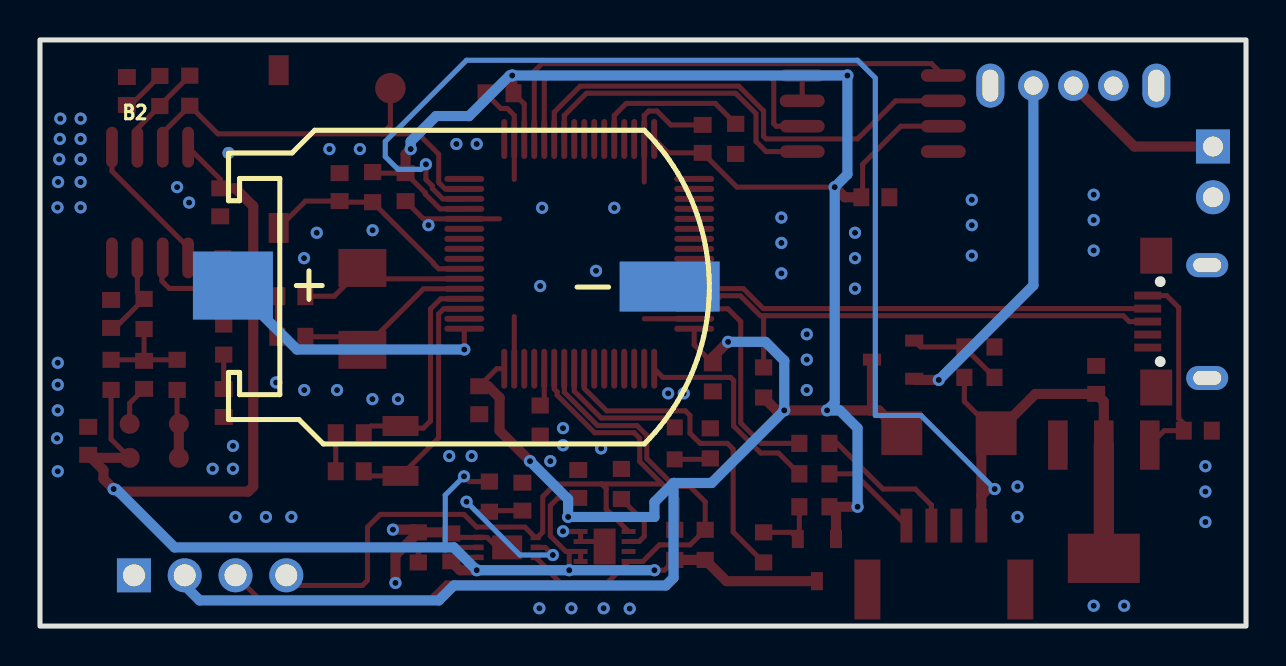
[diagram p3: board, bottom side, seen from below]

Outline 60.33 x 29.34 mm; copper layers: Top Layer, Bottom Layer. Coordinates in mm from the lower left corner of the outline.
Outline path: rectangle 0,29.34 60.33,0
Stack: Top Layer 0.035mm / Dielectric1 1.51mm FR4 er 4.5 / Bottom Layer 0.035mm

## Design rules (mm)
net RTC_OSC_OUT: DP1
net RTC_OSC_IN: DP1
template: JLCPCB Capability(Two Layers Board)
spacing copperThickness1oz (default): track to track 0.102, other pairs 0.152 to 0.3
spacing copperThickness2oz: track to track 0.203, other pairs 0.152 to 0.3
track width copperThickness1oz (default): min 0.127, default 0.254, max 2.54
track width copperThickness2oz: min 0.203, default 0.254, max 2.54
differential pair differentialPair (default): width min 0.127, default 0.254, max 2.54; gap min 0.152, default 0.152
via viaSize (default): diameter min 0.5, default 0.61, max 10; hole min 0.3, default 0.305, max 6.3

## Placement (name value [footprint] x y rotation side)
B2  BS-8-1  [BAT-TH_BS-8-1]  39.75 17.02 180 bottom
C2  10uF  [C0603]  2.41 9.78 0 top
C3  10uF  [C0603]  7.49 12.32 270 top
C4  100nF  [C0603]  37.34 26.67 180 top
C5  100nF  [C0603]  42.04 21.97 90 top
C6  100nF  [C0603]  26.67 12.45 90 top
C7  100nF  [C0603]  38.35 11.3 90 top
C8  7pF  [C0603]  44.83 9.65 180 top
C9  7pF  [C0603]  44.83 7.75 180 top
C10  20pF  [C0603]  47.75 14.48 0 top
C11  20pF  [C0603]  47.75 16.51 0 top
C12  100nF  [C0603]  45.34 21.97 270 top
C13  100nF  [C0603]  39.75 3.94 270 top
C14  100nF  [C0603]  36.19 6.48 270 top
C15  100nF  [C0603]  33.4 7.11 270 top
C16  100nF  [C0603]  51.31 21.21 90 top
C17  100nf  [C0603]  55.12 12.57 90 top
C19  100nF  [C0603]  57.91 9.27 270 top
C20  100nf  [C0603]  51.14 11.16 270 top
C22  100nf  [C0603]  55.98 26.78 90 top
C23  100nF  [C0603]  27.18 24.38 270 top
C25  100nF  [C0603]  18.54 21.46 180 top
C26  100nF  [C0603]  56.77 15.62 270 top
CN1  A1257WR-S-4P  [CONN-SMD_A1257WR-S-4P]  15.11 3.43 0 top
D1  VS-10BQ015HM3/5BT  [SMB_L4.6-W3.6-LS5.3-RD]  14.86 9.65 180 top
H5  -  [HDR-TH_2P-P2.54-V-F]  1.65 22.73 270 top
LED1  19-217/GHC-YR1S2/3T  [LED0603-RD]  28.58 9.14 90 top
MIC1  WMM7037AT2  [MIC-SMD_L3.8-W3.00-TL]  54.61 9.27 270 top
NOREF  -  [Pad_e740]  42.8 26.92 0 top
OLED1  -  [HDR-TH_4P-P2.54-V-F]  51.82 2.54 180 top
Q2  AO3401  [SOT-23-3_L2.9-W1.4-P1.90-LS2.6-BR]  17.65 13.33 180 top
Q3  AO3401  [SOT-23-3_L2.9-W1.4-P1.90-LS2.6-BR]  21.46 3.3 90 top
R8  1.5k  [R0603]  24.13 12.19 90 top
R13  120Ω  [R0603]  21.59 7.62 180 top
R14  120Ω  [R0603]  21.59 9.14 180 top
R15  10kΩ  [R0603]  43.69 21.97 90 top
R21  1kΩ  [R0603]  35.31 10.29 270 top
R23  10kΩ  [R0603]  13.34 13.97 0 top
R24  4.7kΩ  [R0603]  28.58 4.06 270 top
R25  4.7kΩ  [R0603]  27.05 4.06 270 top
R26  10kΩ  [R0603]  31.24 7.11 90 top
R27  10kΩ  [R0603]  41.4 3.94 90 top
R28  1kΩ  [R0603]  37.85 6.48 90 top
R29  100Ω  [R0603]  13.34 12.45 0 top
R30  120kΩ  [R0603]  51.18 17.65 90 top
R31  10kΩ  [R0603]  51.14 14.34 270 top
R33  1MΩ  [R0603]  56.77 12.57 270 top
R34  1MΩ  [R0603]  53.47 12.57 90 top
R35  10kΩ  [R0603]  54.33 26.78 90 top
R36  120kΩ  [R0603]  52.83 26.8 90 top
R37  1kΩ  [R0603]  25.53 24.38 270 top
R38  1kΩ  [R0603]  26.8 9.14 90 top
R39  1kΩ  [R0603]  24.13 3.94 270 top
R40  100kΩ  [R0603]  21.59 5.97 0 top
R41  100  [R0603]  55.12 15.62 90 top
S1  SHT31-DIS-B2.5kS  [DFN-8_L2.5-W2.5-P0.50-BL-EP]  32.08 3.98 270 top
SW1  K2-1107ST-A4SW-06  [SW-SMD_L6.1-W3.6-LS7.9]  48.39 23.88 270 top
SW3  SK12D07VG4  [SW-TH_SK12D07VG4]  8.64 27.05 180 top
U1  STM32F103RGT6  [LQFP-64_L10.0-W10.0-P0.50-LS12.0-BL]  33.35 18.63 90 top
U2  AMS1117-3.3  [SOT-223-4_L6.5-W3.5-P2.30-LS7.0-BR]  7.11 6.22 90 top
U3  BH1750FVI-TR  [WSOF-6_L2.6-W1.6-P0.50-TL-EP]  36.96 3.94 180 top
U4  MCP6022-I/SN  [SOIC-8_L4.9-W3.9-P1.27-LS6.0-BL]  54.82 21.2 0 top
U7  W25Q128JVSIQ  [SOIC-8_L5.3-W5.3-P1.27-LS8.0-BL]  18.67 25.65 270 top
USB1  U254-051T-4BH83-S1S  [MICRO-USB-SMD_U254-051T-4BH83-S1S]  3.43 15.24 270 top
X1  32.768kHz  [FC-135R_L3.2-W1.5]  42.29 8.76 270 top
X2  8MHz  [CRYSTAL-SMD_L5.0-W3.2]  44.2 15.88 270 top

## Footprints (pads in the part's own frame, mm; a bottom-side part is the same pattern mirrored in y, then rotated)
BAT-TH_BS-8-1
  rect 4x3.4 smd: 1(-10.922,0.025)
  rect 5x2.5 smd: 2(10.922,-0.025)
C0603
  rect 0.8x0.9 smd: 1(-0.7,0) 2(0.7,0)
CONN-SMD_A1257WR-S-4P
  rect 0.6x1.7 smd: 1(1.875,1.6) 2(0.625,1.6) 3(-0.625,1.6) 4(-1.875,1.6)
  rect 1.3x3 smd: 5(3.825,-1.6) 6(-3.825,-1.6)
CRYSTAL-SMD_L5.0-W3.2
  rect 1.9x2.4 smd: 1(-2.05,0) 2(2.05,0)
DFN-8_L2.5-W2.5-P0.50-BL-EP
  rect 0.25x0.7 smd: 1(-0.75,-1.2) 2(-0.25,-1.2) 3(0.25,-1.2) 4(0.75,-1.2) 5(0.75,1.2) 6(0.25,1.2) 7(-0.25,1.2) 8(-0.75,1.2)
  rect 1.8x1.1 smd: 9(0,0)
FC-135R_L3.2-W1.5
  rect 1x1.8 smd: 1(-1.25,0) 2(1.25,0)
HDR-TH_2P-P2.54-V-F
  rect 1.7x1.7 hole 1: 1(-1.27,0)
  round 1.7 hole 1: 2(1.27,0)
HDR-TH_4P-P2.54-V-F
  rect 1.7x1.7 hole 1.1: 1(-3.81,0)
  round 1.7 hole 1.1: 2(-1.27,0) 3(1.27,0) 4(3.81,0)
LED0603-RD
  rect 0.8x0.8 smd: 1(-0.799,-0.004) 2(0.799,0.004)
LQFP-64_L10.0-W10.0-P0.50-LS12.0-BL
  oval 0.3x2 smd: 1(-3.75,-5.75) 2(-3.25,-5.75) 3(-2.75,-5.75) 4(-2.25,-5.75) 5(-1.75,-5.75) 6(-1.25,-5.75) 7(-0.75,-5.75) 8(-0.25,-5.75) 9(0.25,-5.75) 10(0.75,-5.75) 11(1.25,-5.75) 12(1.75,-5.75) 13(2.25,-5.75) 14(2.75,-5.75) 15(3.25,-5.75) 16(3.75,-5.75) 33(3.75,5.75) 34(3.25,5.75) 35(2.75,5.75) 36(2.25,5.75) 37(1.75,5.75) 38(1.25,5.75) 39(0.75,5.75) 40(0.25,5.75) 41(-0.25,5.75) 42(-0.75,5.75) 43(-1.25,5.75) 44(-1.75,5.75) 45(-2.25,5.75) 46(-2.75,5.75) 47(-3.25,5.75) 48(-3.75,5.75)
  oval 2x0.3 smd: 17(5.75,-3.75) 18(5.75,-3.25) 19(5.75,-2.75) 20(5.75,-2.25) 21(5.75,-1.75) 22(5.75,-1.25) 23(5.75,-0.75) 24(5.75,-0.25) 25(5.75,0.25) 26(5.75,0.75) 27(5.75,1.25) 28(5.75,1.75) 29(5.75,2.25) 30(5.75,2.75) 31(5.75,3.25) 32(5.75,3.75) 49(-5.75,3.75) 50(-5.75,3.25) 51(-5.75,2.75) 52(-5.75,2.25) 53(-5.75,1.75) 54(-5.75,1.25) 55(-5.75,0.75) 56(-5.75,0.25) 57(-5.75,-0.25) 58(-5.75,-0.75) 59(-5.75,-1.25) 60(-5.75,-1.75) 61(-5.75,-2.25) 62(-5.75,-2.75) 63(-5.75,-3.25) 64(-5.75,-3.75)
MIC-SMD_L3.8-W3.00-TL
  round 1 smd: 1(0.85,1.23) 2(0.85,-1.23) 3(-0.85,-1.23) 4(-0.85,1.23)
MICRO-USB-SMD_U254-051T-4BH83-S1S
  rect 0.4x1.35 smd: 1(-1.3,1.488) 2(-0.65,1.488) 3(0,1.488) 4(0.65,1.488) 5(1.3,1.488)
  rect 1.8x1.6 smd: 6(-3.3,1.062) 6(3.3,1.062)
  oval 1.2x2.1 hole 0.7x1.4: 6(-2.825,-1.488) 6(2.825,-1.488)
Pad_e740
  round 1.524 smd: 1(0,0)
R0603
  rect 0.806x0.864 smd: 1(-0.753,0) 2(0.753,0)
SMB_L4.6-W3.6-LS5.3-RD
  rect 2.047x2.192 smd: 1(-2.361,0) 2(2.361,0)
SOIC-8_L4.9-W3.9-P1.27-LS6.0-BL
  oval 0.588x2.045 smd: 1(-1.905,-2.772) 2(-0.635,-2.772) 3(0.635,-2.772) 4(1.905,-2.772) 5(1.905,2.772) 6(0.635,2.772) 7(-0.635,2.772) 8(-1.905,2.772)
SOIC-8_L5.3-W5.3-P1.27-LS8.0-BL
  oval 0.63x2.25 smd: 1(-1.905,-3.53) 2(-0.635,-3.53) 3(0.635,-3.53) 4(1.905,-3.53) 5(1.905,3.53) 6(0.635,3.53) 7(-0.635,3.53) 8(-1.905,3.53)
SOT-23-3_L2.9-W1.4-P1.90-LS2.6-BR
  rect 0.91x0.6 smd: 1(1.055,-0.955) 2(1.055,0.955) 3(-1.055,0)
SOT-223-4_L6.5-W3.5-P2.30-LS7.0-BR
  rect 2.47x0.98 smd: 1(2.835,-2.3) 2(2.835,0) 3(2.835,2.3)
  rect 2.47x3.6 smd: 4(-2.835,0)
SW-SMD_L6.1-W3.6-LS7.9
  rect 1.5x1 smd: 1(-3.95,0) 2(3.95,0)
SW-TH_SK12D07VG4
  round 1.524 hole 0.914: 1(-2,0) 2(0,0) 3(2,0)
  oval 1.4x2.2 hole 0.8x1.6: 4(4.15,0) 5(-4.15,0)
WSOF-6_L2.6-W1.6-P0.50-TL-EP
  rect 0.505x0.28 smd: 1(-1.427,0.5) 2(-1.427,0) 3(-1.427,-0.5) 4(1.427,-0.5) 5(1.427,0) 6(1.427,0.5)
  rect 1.5x1.2 smd: 7(0,0)

## Nets
As in the schematic, except:
GND: B2.2 C2.1 C3.1 C4.1 C5.1 C6.1 C7.1 C8.1 C9.1 C10.2 C11.2 C12.1 C13.1 C14.1 C15.1 C16.1 C19.1 C20.2 C22.2 C23.1 C25.2 C26.1 CN1.3 CN1.5 CN1.6 H5.2 MIC1.2 MIC1.3 OLED1.1 R21.2 R23.1 R26.2 R27.2 R34.1 R37.2 R38.2 S1.7 S1.8 S1.9 SW1.1 U1.12 U1.18 U1.31 U1.47 U1.63 U2.1 U3.3 U3.7 U4.4 U7.4 USB1.5 USB1.6
MIC: NOREF.1 R36.1 U1.15 U4.7
RTC_OSC_IN: C9.2 U1.3 X1.2
RTC_OSC_OUT: C8.2 U1.4 X1.1

Pads without a net: S1 3; SW3 3 4 5; U1 2 8 9 10 11 16 17 24 25 26 27 29 30 33 34 35 36 37 38 39 40 41 50 51 52 53 54 55 61 62; USB1 4

## Via types
v1: diameter 0.61, hole 0.305, Top Layer to Bottom Layer, 99 vias

## Routing (per net, layer and track width the routed paths; a pad name or vN(x,y) marks a point on that pad's centre or on a via; arc(x,y) is an arc through that point)
3V3: length 155.1
  Top Layer w0.254: C4.2 36.1,26.13 U1.19 ; U7.8 U7.7 ; C7.2 37.48,12.88 U1.64 ; U7.3 17.27,25.02 19.18,23.11 19.18,21.53 C25.1 ; U1.13 40.31,20.88 41.05,21.62 41.05,21.69 C5.2 43.63,22.67 R15.2 ; U1.48 27.6,14.08 C6.2 ; v1(20.57,21.97) 25.47,21.97 C23.2 28.91,23.68 U1.32
  Top Layer w0.508: C5.2 42.04,23.62 v1(41.78,23.88) ; R8.1 23.49,10.8 v1(23.1,10.8) v1(20.96,10.8) 18.83,10.8 ; v1(19.43,5.97) R40.1 20.51,5.64 Q3.2 ; 18.83,10.8 18.36,10.8 D1.1 ; 18.83,10.8 18.71,10.91 Q2.3 ; U7.8 v1(19.94,27.56) ; C4.2 36.7,26.73 v1(36.7,27.56) ; C6.2 26.67,13.46 v1(25.91,14.22) ; v1(35.81,8.25) 37.34,9.78 37.34,11.43 37.91,12 C7.2 ; C25.1 20.07,21.46 v1(20.57,21.97)
  Bottom Layer w0.508: 28.63,7.16 28.63,2.41 29.02,2.03 39.62,2.03 40.37,1.28 52.34,1.28 53.09,2.03 OLED1.2 ; 28.63,7.16 29.59,6.2 29.59,5.46 v1(33.91,5.46) 33.91,6.35 v1(35.81,8.25) ; 28.63,7.16 26.73,7.16 v1(23.1,10.8) 23.1,13.28 24.04,14.22 v1(25.91,14.22) ; v1(19.43,5.97) 19.43,9.91 20.32,10.8 v1(20.96,10.8) 20.57,11.18 v1(20.57,21.97) 19.94,22.61 v1(19.94,27.56) v1(36.7,27.56) 36.83,27.56 38.86,25.53 40.51,25.53 41.78,24.26 v1(41.78,23.88)
3V3IN: length 80.7
  Top Layer w0.254: R29.2 14.09,11.24 D1.2 ; v1(41.02,23.11) 41.02,22.35 40.7,22.03 40.7,21.9 40.18,21.38 U1.14
  Top Layer w0.508: v1(12.57,6.86) 12.92,6.86 13.24,6.54 ; 13.24,6.54 13.24,8.91 D1.2 10.53,11.62 C3.2 7.11,11.24 U2.2 ; 13.24,6.54 CN1.4
  Top Layer w1.016: U2.2 U2.4
  Bottom Layer w0.254: v1(12.57,6.86) 16.26,10.54 18.54,10.54 18.54,27.43 19.43,28.32 38.99,28.32 43.05,24.26 43.05,23.5 42.42,22.86 41.28,22.86 v1(41.02,23.11)
+5V: length 10.1
  Top Layer w0.254: U2.3 4.09,9.78 C2.2 3.11,10.14 3.37,10.39 3.37,15.94 3.97,16.54 USB1.1
GND: length 41.1
  Top Layer w0.254: U1.63 36.6,15.49 ; 37.34,20.38 U1.12 41.15,20.38 C5.1 ; 30.1,22.22 U1.31 30.1,25.56 29.88,25.78 29.46,25.78 28.77,25.08 C23.1 ; C4.1 37.28,25.91 36.95,25.91 36.6,25.56 U1.18 36.6,22.35 ; MIC1.3 53.47,10.21 R34.1 ; v1(34.16,4.74) 34.15,4.73 33.28,4.73 33.28,4.23 32.33,4.23 S1.9 ; C13.1 39.55,4.44 U3.3 37.95,4.44 37.45,3.94 U3.7 ; U1.47 30.1,15.38 ; C8.1 C9.1 ; C10.2 C11.2
  Top Layer w0.508: MIC1.2 MIC1.3 ; v1(42.67,4.83) 41.54,4.83 R27.2 ; C13.1 39.8,4.69 R27.2 ; R27.2 42.55,3.55 v1(42.55,2.16)
  vias: v1(2.03,8) v1(2.03,6.73) v1(2.03,5.21) v1(6.1,1.02) v1(7.62,21.59) v1(7.62,20.32) v1(7.62,18.8) v1(7.62,1.02) v1(11.43,6.98) v1(11.43,5.46) v1(13.72,21.34) v1(13.72,20.07) v1(13.72,18.54) v1(19.56,19.69) v1(19.56,18.42) v1(19.56,16.89) v1(21.97,14.61) v1(21.97,13.33) v1(21.97,11.81) v1(23.24,20.45) v1(23.24,19.18) v1(23.24,17.65) v1(28.12,11.65) v1(28.91,11.65) v1(30.83,0.87) v1(31.6,20.93) v1(32.13,0.89) v1(32.26,8.89) v1(32.51,17.78) v1(33.75,0.89) v1(34.16,9.91) v1(34.16,9.05) v1(34.8,8.25) v1(35.21,20.93) v1(35.31,17.02) v1(35.35,0.89) v1(38.48,24.13) v1(38.74,8.51) v1(39.5,24.13) v1(39.86,8.51) v1(40.89,20.07) v1(42.42,11.36) v1(43.69,19.81) v1(43.7,11.36) v1(44.32,23.88) v1(45.47,11.81) v1(45.85,23.88) v1(46.48,19.69) v1(47.12,18.42) v1(47.11,11.81) v1(47.75,5.46) v1(48.51,12.19) v1(49.02,5.46) v1(50.55,5.46) v1(50.67,9.02) v1(50.67,7.87) v1(50.9,23.68) v1(51.69,7.87) v1(52.87,21.2) v1(53.47,21.97) v1(58.29,25.4) v1(58.29,24.38) v1(58.29,23.37) v1(58.29,22.22) v1(58.29,20.95) v1(59.31,25.4) v1(59.33,24.38) v1(59.36,23.37) v1(59.42,22.22) v1(59.45,20.95) v1(59.44,13.18) v1(59.44,12.08) v1(59.44,10.8) v1(59.47,9.4) v1(59.44,7.75)
VBAT: length 13.9
  Top Layer w0.254: v1(39.1,13.84) U1.1
  Bottom Layer w0.508: B2.1 47.47,13.84 v1(39.1,13.84)
VCC: length 86
  Top Layer w0.254: 33.85,3.73 33.28,3.73 33.28,3.23 ; 33.85,3.73 v1(33.85,2.79) ; 33.85,3.73 34.02,3.73 34.8,4.51 34.8,6.03 34.42,6.41 C15.2 ; U4.8 51.31,22.36 C16.2 ; v1(29.59,2.79) 29.09,2.79 R24.2 ; MIC1.1 56.77,9.35 R33.2 ; R28.2 38.85,7.23 v1(39.12,7.49) ; U3.1 39.55,3.44 C13.2
  Top Layer w0.508: C13.2 39.31,2.79 v1(38.48,2.79) ; MIC1.1 57.76,8.42 ; 57.76,8.42 C19.2 ; 57.76,8.42 57.15,7.81 57.15,7.37 v1(56.64,6.86) 56.52,6.73 49.91,6.73 49.66,6.98 49.66,21.01 50.55,21.91 C16.2 ; Q3.3 25.99,2.25 R25.2 R24.2
  Bottom Layer w0.254: 40.05,3.94 40.05,6.56 v1(39.12,7.49)
  Bottom Layer w0.508: v1(29.59,2.79) v1(33.85,2.79) v1(38.48,2.79) 39.62,3.94 53.59,3.94 56.52,6.86 v1(56.64,6.86)
VIN: length 17.9
  Top Layer w0.508: Q2.2 16.54,12.32 v1(15.37,12.32)
  Bottom Layer w0.508: v1(15.37,12.32) 10.64,17.05 SW3.1
BOOT0: length 1.9
  Top Layer w0.254: U1.60 35.1,11.25 R21.1
BOOT1: length 7.9
  Top Layer w0.254: R37.1 26.55,26.16 31,26.16 31.6,25.56 U1.28
FLASH_CS: length 24.3
  Top Layer w0.254: U7.1 15.73,28.15 35.22,28.15 35.6,27.77 U1.20
I2C1_SCL: length 39.8
  Top Layer w0.254: 34.29,2.16 35.05,2.92 35.05,2.96 U3.6 ; 34.29,2.16 31.96,2.16 30.88,3.23 30.17,3.23 29.34,4.06 27.8,4.06 R25.1 27.05,6.22 27.81,6.98 28.58,6.98 29.97,8.38 29.97,9.55 30.46,10.03 32.43,10.03 34.1,11.7 U1.58 ; 34.29,2.16 40,2.16 40.77,1.4 49.4,1.4 OLED1.3
I2C1_SDA: length 39.4
  Top Layer w0.254: 29.21,7.11 30.33,8.23 30.33,9.4 30.61,9.68 32.58,9.68 34.46,11.56 34.46,11.72 34.6,11.87 U1.59 ; 29.21,7.11 28.45,6.35 28.45,4.94 R24.1 ; 29.21,7.11 32.23,7.11 ; OLED1.4 47.5,2.03 44.2,2.03 43.94,2.29 43.94,4.95 43.31,5.59 39.12,5.59 38.48,4.95 36.07,4.95 35.55,4.44 U3.4 35.44,4.44 35.18,4.7 35.18,6.48 34.54,7.11 32.23,7.11 ; S1.1 31.99,5.84 32,5.84 32,6.88 32.23,7.11
LED: length 6.9
  Top Layer w0.254: U1.57 33.6,11.76 32.26,10.41 29.04,10.41 LED1.2
MIC: length 21.4
  Top Layer w0.254: 43.21,24.64 42.8,25.05 NOREF.1 ; 43.21,24.64 51.43,24.64 R36.1 54.18,24.69 U4.7 ; 43.21,24.64 41.4,24.64 40.38,23.62 40.38,22.2 40.06,21.88 U1.15
MIC_OUT: length 2.1
  Top Layer w0.254: MIC1.4 55.84,11.15 C17.1
NRST: length 11.3
  Top Layer w0.254: SW1.2 47.04,21.27 C12.2 45.29,21.22 R15.1 40.64,18.17 40.64,18.13 40.39,17.88 U1.7
OSC_IN: length 9.5
  Top Layer w0.254: C10.1 44.85,14.48 X2.2 41.14,16.88 U1.5
OSC_OUT: length 8.8
  Top Layer w0.254: U1.6 43.65,17.38 X2.1 45.61,16.51 C11.1
RTC_OSC_IN: length 12.2
  Top Layer w0.254: C9.2 43.9,7.51 X1.2 40.39,9.42 40.39,15.62 40.13,15.88 U1.3
RTC_OSC_OUT: length 11.2
  Top Layer w0.254: C8.2 43.77,10.01 X1.1 42.18,9.91 41.15,9.91 40.79,10.26 40.79,15.87 40.28,16.38 U1.4
SPI_MISO: length 24
  Top Layer w0.254: U7.2 17.53,26.29 19.43,24.38 24,24.38 24.13,24.51 24.13,25.78 25.38,27.03 33.3,27.03 34.6,25.72 U1.22
SPI_MOSI: length 15.6
  Top Layer w0.254: U7.5 24,23.75 24.51,24.26 24.51,25.65 25.53,26.67 32.99,26.67 34.1,25.56 U1.23
SPI_SCK: length 18.3
  Top Layer w0.254: U7.6 23.5,25.02 23.62,25.14 23.62,27.3 23.88,27.56 34.85,27.56 35.1,27.3 U1.21
SWCLK: length 10.8
  Top Layer w0.254: R13.1 23.38,8.66 24.28,8.66 25.63,10.01 25.63,12.29 25.78,12.45 29.17,12.45 U1.49
SWDIO: length 11
  Top Layer w0.254: R14.1 24.26,9.14 25.27,10.16 25.27,15.24 25.91,15.88 U1.46
USB_DM: length 23.1
  Top Layer w0.254: USB1.2 24.15,15.89 25.15,16.89 27.59,16.89 U1.44
USB_DP: length 25.9
  Top Layer w0.254: 24.05,15.53 24.29,15.53 25.29,16.53 26.27,16.53 26.42,16.38 U1.45 ; 24.05,15.53 6.14,15.53 5.84,15.24 USB1.3 ; 24.05,15.53 24.13,15.45 R8.2
VCONT: length 16.5
  Top Layer w0.254: R39.2 25.65,4.71 25.65,8.86 25.94,9.14 27.31,9.14 27.81,9.65 27.81,10.54 28.04,10.77 31.98,10.77 33.1,11.89 U1.56
$1N4035: length 4.8
  Top Layer w0.254: R29.1 14.09,13.95 R23.2 16.28,13.97 16.6,14.29
$1N4154: length 4.9
  Top Layer w0.254: R13.2 19.58,7.62 CN1.1
$1N4190: length 7.4
  Top Layer w0.254: R14.2 20.45,9.14 18.16,6.86 16.54,6.86 15.74,6.06 CN1.2
$1N11068: length 1.8
  Top Layer w0.254: R38.1 26.84,8.34 LED1.1
$1N11257: length 8.2
  Top Layer w0.508: SW3.2 5.59,24 H5.1
$1N13765: length 3.5
  Top Layer w0.254: R39.1 22.75,4.69 Q3.1 22.34,4.43 R40.2
$2N250: length 3.2
  Top Layer w0.254: R26.1 30.1,5.22 30.1,4.49 30.35,4.23 S1.2
$2N452: length 3.6
  Top Layer w0.254: R27.1 41.4,3.68 41.15,3.94 U3.2
$2N578: length 9.5
  Top Layer w0.254: C14.2 37.79,5.78 R28.1 38.49,5.72 v1(38.99,6.22) ; v1(34.67,3.56) 35.05,3.94 U3.5
  Bottom Layer w0.254: v1(38.99,6.22) 36.32,3.56 v1(34.67,3.56)
$2N2027: length 1.7
  Top Layer w0.254: R31.2 C20.1
$2N2052: length 6.2
  Top Layer w0.254: R31.1 51.18,15.14 R30.1 53.86,16.9 54.23,17.27 54.23,18.38 U4.2
$2N2158: length 8.9
  Top Layer w0.254: R30.2 52.9,18.41 U4.1 52.91,18.96 56.72,22.77 U4.5
$2N2251: length 2.3
  Top Layer w0.254: C22.1 55.78,26.08 R35.2
$2N2310: length 4.7
  Top Layer w0.254: R36.2 54.33,26.05 R35.1 55.45,24.9 U4.6
$2N5780: length 4.9
  Top Layer w0.254: C17.2 R41.1 ; C17.2 55.06,13.33 R34.2 ; C17.2 55.17,13.33 R33.1
$2N5887: length 4.4
  Top Layer w0.254: C26.2 56.57,14.92 R41.2 55.45,16.71 U4.3

## Copper pours and planes (outline as drawn; the poured copper is in the pictures)
GND on Top Layer: 0,29.34 60.33,29.34 60.33,0 0,0
GND on Bottom Layer: 0,29.34 60.18,29.34 60.18,0 0,0

## Text on the board
Top Silkscreen Layer: +-DC | D  C  +  - | OFF/ON | MIC | -  +
